# EAGLE design DrivePlexer (EAGLE 7.7.0)
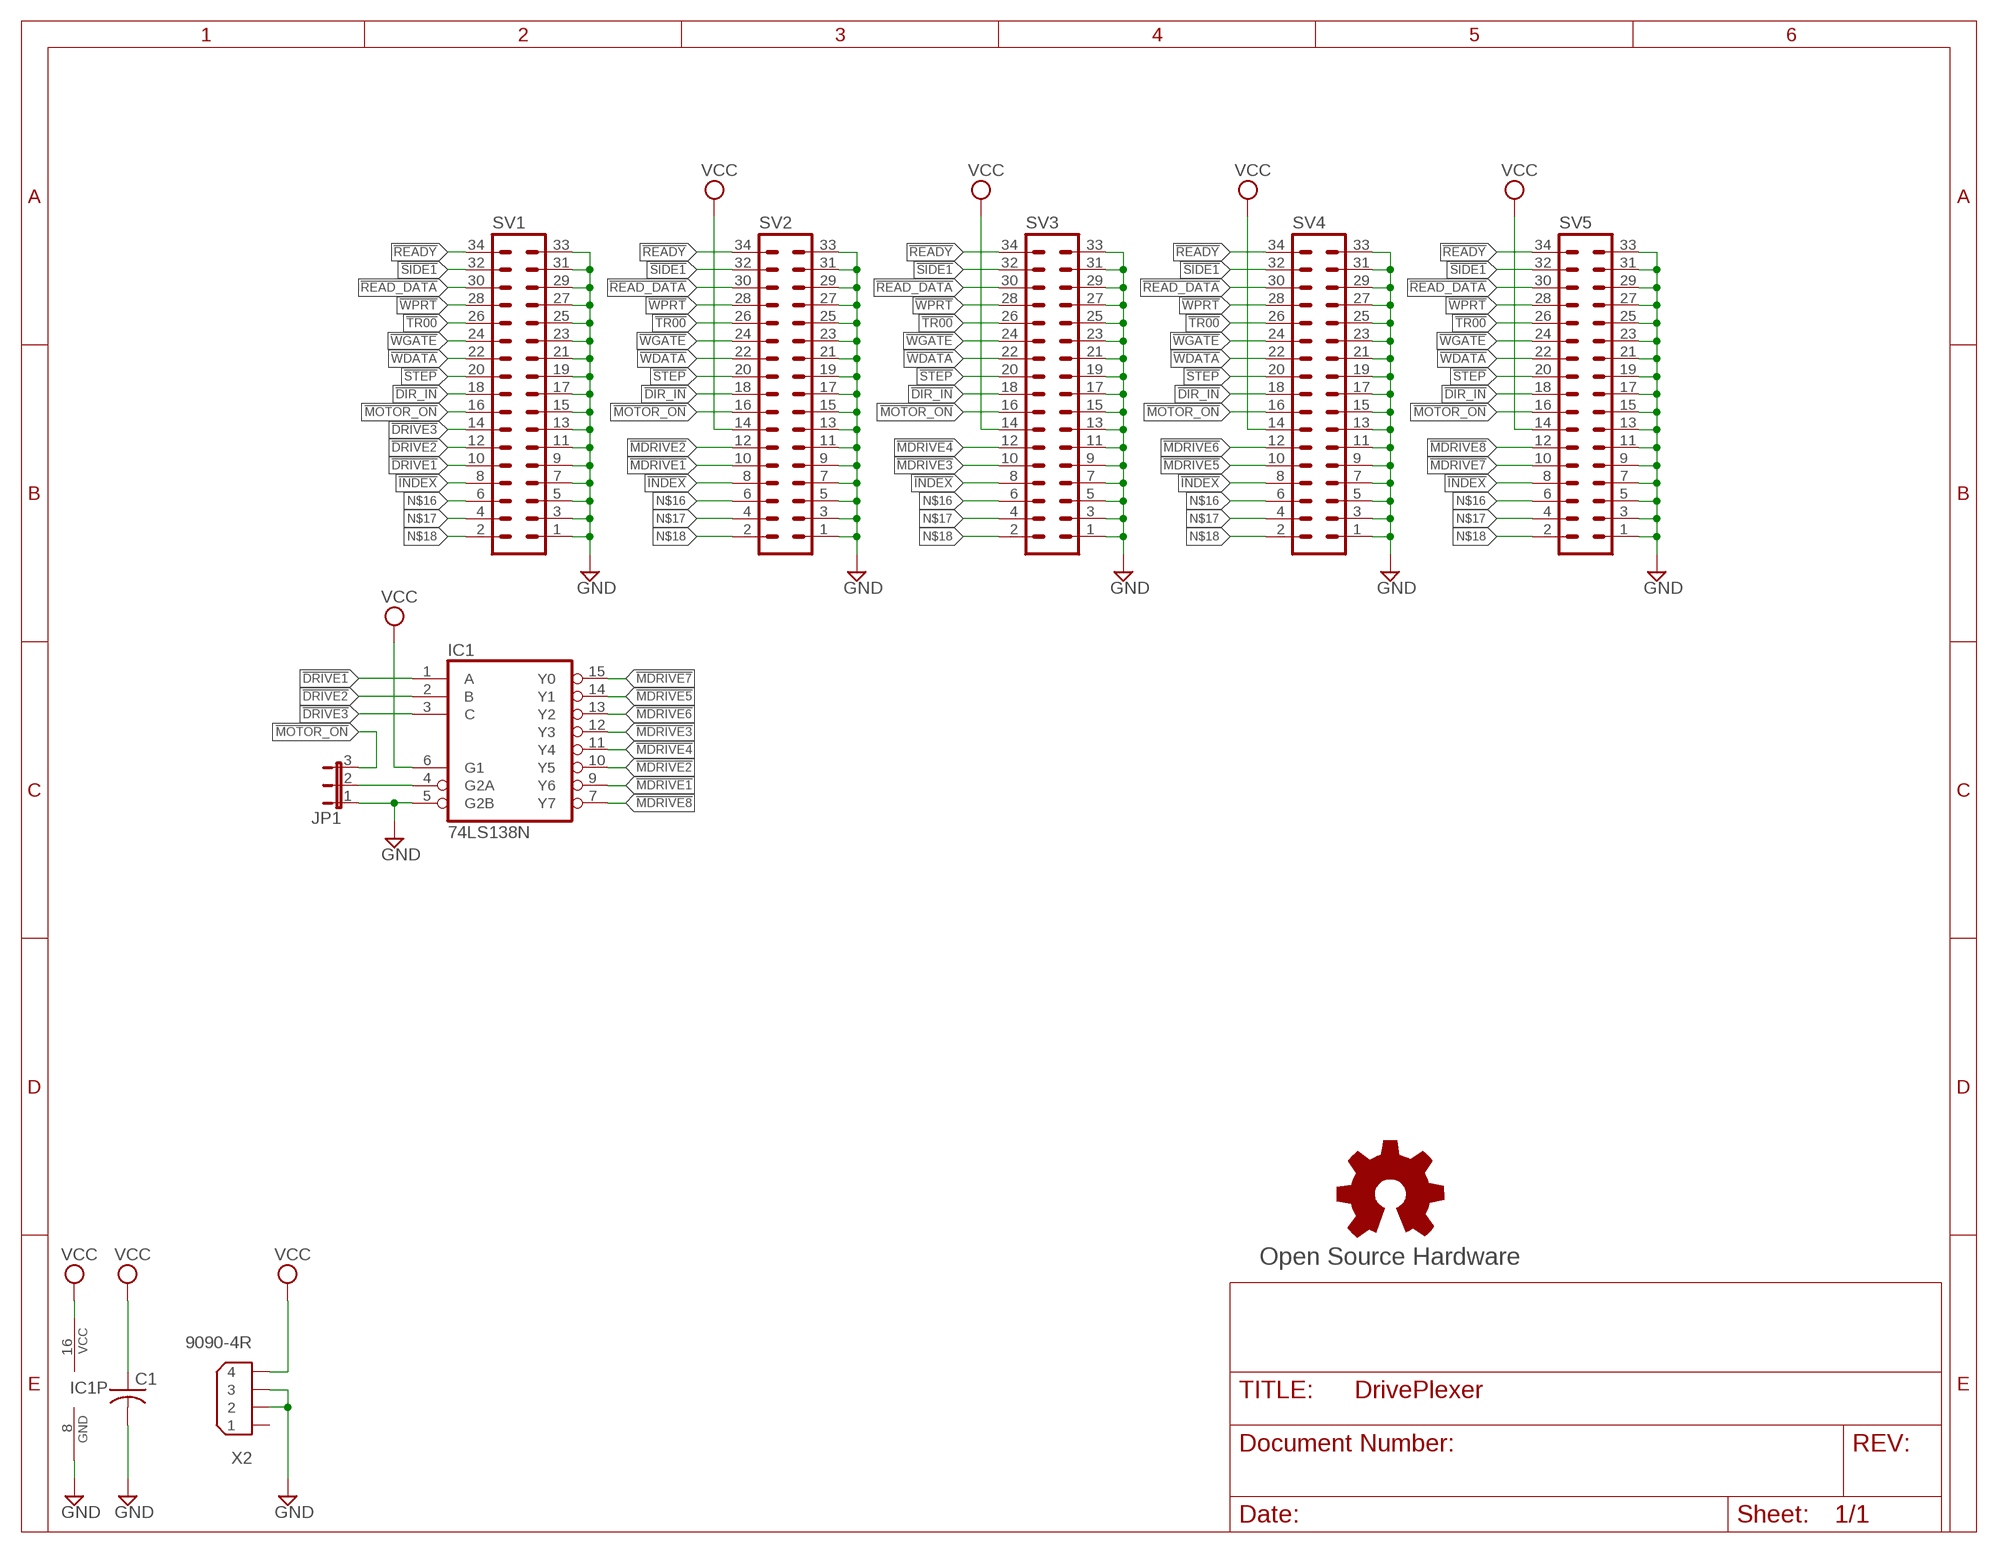
[diagram p0: schematic, sheet 1]

## Parts
C1  C-US025-025X050  [C025-025X050]
GOLD_ORB_SM1  Open Source Hardware  OSHWLOGOLOGO5MM  [OSHW_5MM]
IC1  74LS138N  [DIL16-RP]
JP1  JP2E  [JP2]
SV1  MA17-2  [MA17-2]
SV2  MA17-2  [MA17-2]
SV3  MA17-2  [MA17-2]
SV4  MA17-2  [MA17-2]
SV5  MA17-2  [MA17-2]
X2  9090-4R  [9090-4R]

## Nets
!DIR_IN: SV1.18 SV2.18 SV3.18 SV4.18 SV5.18
!DRIVE1: IC1.1(A) SV1.10
!DRIVE2: IC1.2(B) SV1.12
!DRIVE3: IC1.3(C) SV1.14
!INDEX: SV1.8 SV2.8 SV3.8 SV4.8 SV5.8
!MDRIVE1: IC1.9(Y6) SV2.10
!MDRIVE2: IC1.10(Y5) SV2.12
!MDRIVE3: IC1.12(Y3) SV3.10
!MDRIVE4: IC1.11(Y4) SV3.12
!MDRIVE5: IC1.14(Y1) SV4.10
!MDRIVE6: IC1.13(Y2) SV4.12
!MDRIVE7: IC1.15(Y0) SV5.10
!MDRIVE8: IC1.7(Y7) SV5.12
!MOTOR_ON: JP1.3 SV1.16 SV2.16 SV3.16 SV4.16 SV5.16
!READ_DATA: SV1.30 SV2.30 SV3.30 SV4.30 SV5.30
!READY: SV1.34 SV2.34 SV3.34 SV4.34 SV5.34
!SIDE1: SV1.32 SV2.32 SV3.32 SV4.32 SV5.32
!STEP: SV1.20 SV2.20 SV3.20 SV4.20 SV5.20
!TR00: SV1.26 SV2.26 SV3.26 SV4.26 SV5.26
!WDATA: SV1.22 SV2.22 SV3.22 SV4.22 SV5.22
!WGATE: SV1.24 SV2.24 SV3.24 SV4.24 SV5.24
!WPRT: SV1.28 SV2.28 SV3.28 SV4.28 SV5.28
GND: C1.2 IC1.5(G2B) IC1.8(GND) JP1.1 SV1.1 SV1.3 SV1.5 SV1.7 SV1.9 SV1.11 SV1.13 SV1.15 SV1.17 SV1.19 SV1.21 SV1.23 SV1.25 SV1.27 SV1.29 SV1.31 SV1.33 SV2.1 SV2.3 SV2.5 SV2.7 SV2.9 SV2.11 SV2.13 SV2.15 SV2.17 SV2.19 SV2.21 SV2.23 SV2.25 SV2.27 SV2.29 SV2.31 SV2.33 SV3.1 SV3.3 SV3.5 SV3.7 SV3.9 SV3.11 SV3.13 SV3.15 SV3.17 SV3.19 SV3.21 SV3.23 SV3.25 SV3.27 SV3.29 SV3.31 SV3.33 SV4.1 SV4.3 SV4.5 SV4.7 SV4.9 SV4.11 SV4.13 SV4.15 SV4.17 SV4.19 SV4.21 SV4.23 SV4.25 SV4.27 SV4.29 SV4.31 SV4.33 SV5.1 SV5.3 SV5.5 SV5.7 SV5.9 SV5.11 SV5.13 SV5.15 SV5.17 SV5.19 SV5.21 SV5.23 SV5.25 SV5.27 SV5.29 SV5.31 SV5.33 X2.2 X2.3
N$5: IC1.4(G2A) JP1.2
N$16: SV1.6 SV2.6 SV3.6 SV4.6 SV5.6
N$17: SV1.4 SV2.4 SV3.4 SV4.4 SV5.4
N$18: SV1.2 SV2.2 SV3.2 SV4.2 SV5.2
VCC: C1.1 IC1.6(G1) IC1.16(VCC) SV2.14 SV3.14 SV4.14 SV5.14 X2.4
Unconnected: X2.1

## Library data of the parts
C1 = rcl:C-US: CAPACITOR, American symbol
GOLD_ORB_SM1 = oshw:OSHWLOGO: The OSHW logo for PCB layout
IC1 = 74xx-us-jlb:74*138: 3-line to 8-line DECODER/DEMULTIPLEXER
JP1 = jumper-jlb:JP2E: JUMPER
SV1-SV5 = con-lstb-rp:MA17-2: PIN HEADER; OC_FARNELL: unknown; OC_NEWARK: unknown
X2 = con-thomas-betts:9090-4: Disk Drive Power four position Source: Thomas & Betts Electronic Interconnects Eiropean Edition 1998; OC_FARNELL: unknown; OC_NEWARK: unknown

## Board
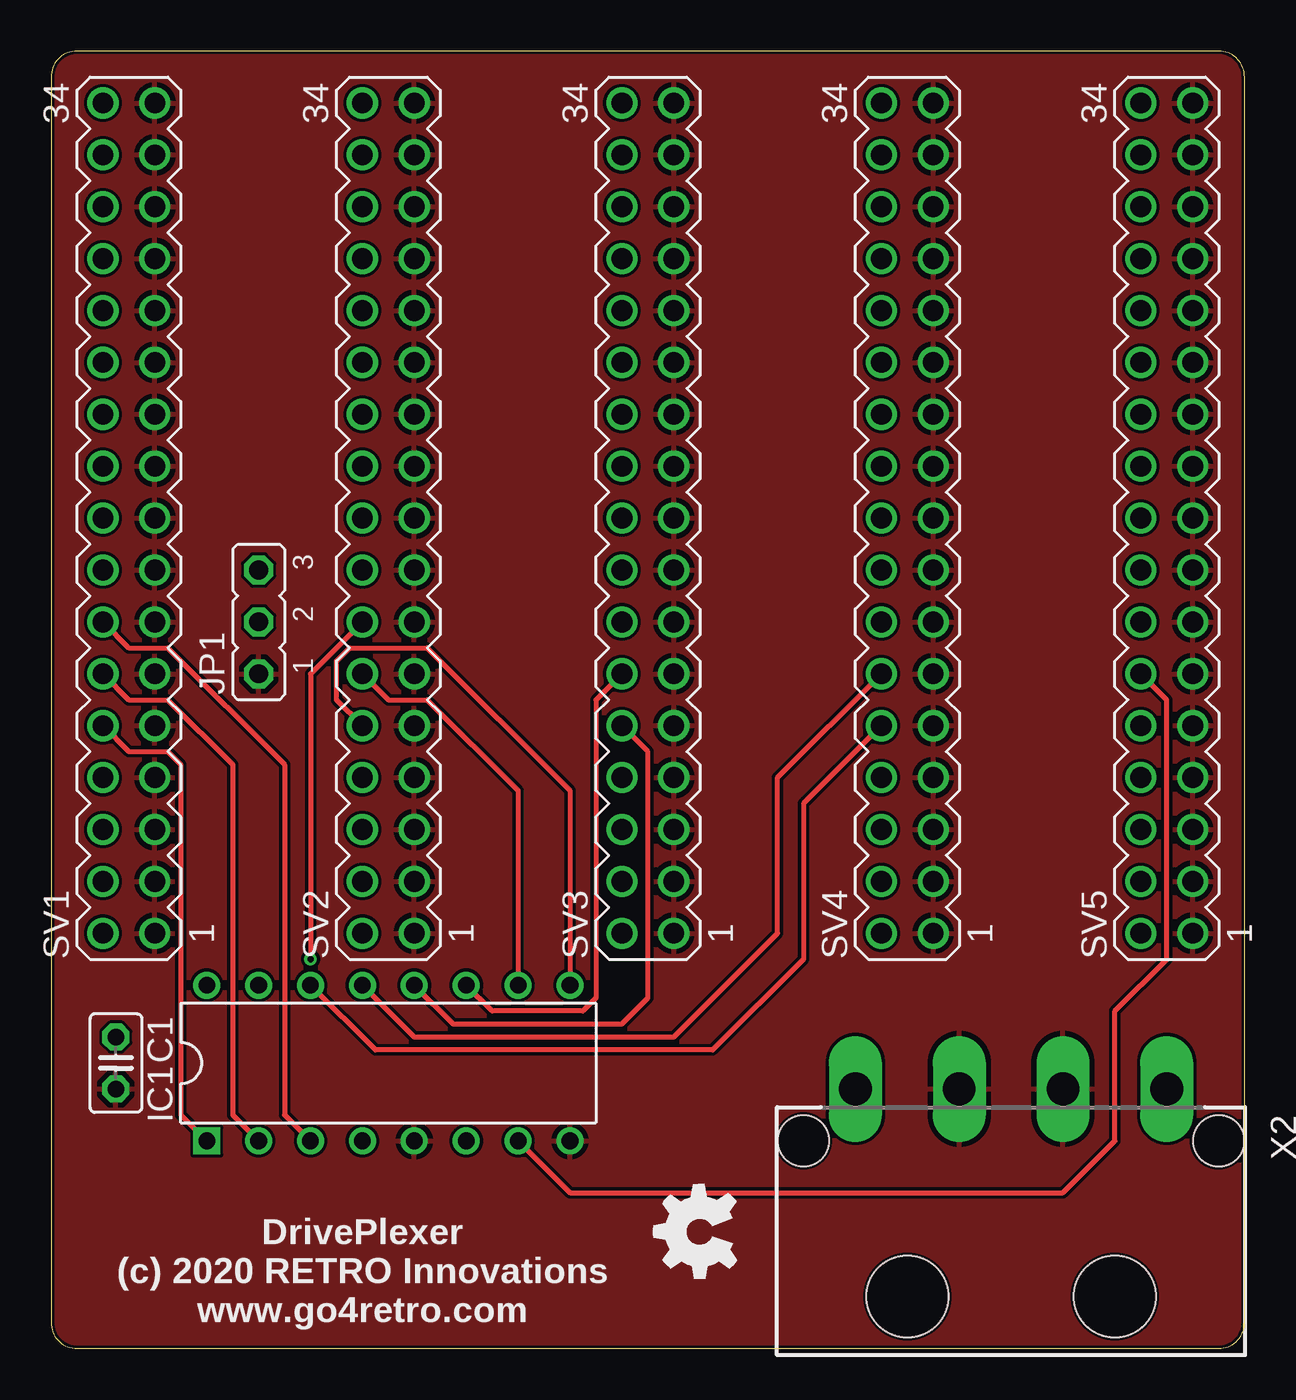
[diagram p1: board, top side]
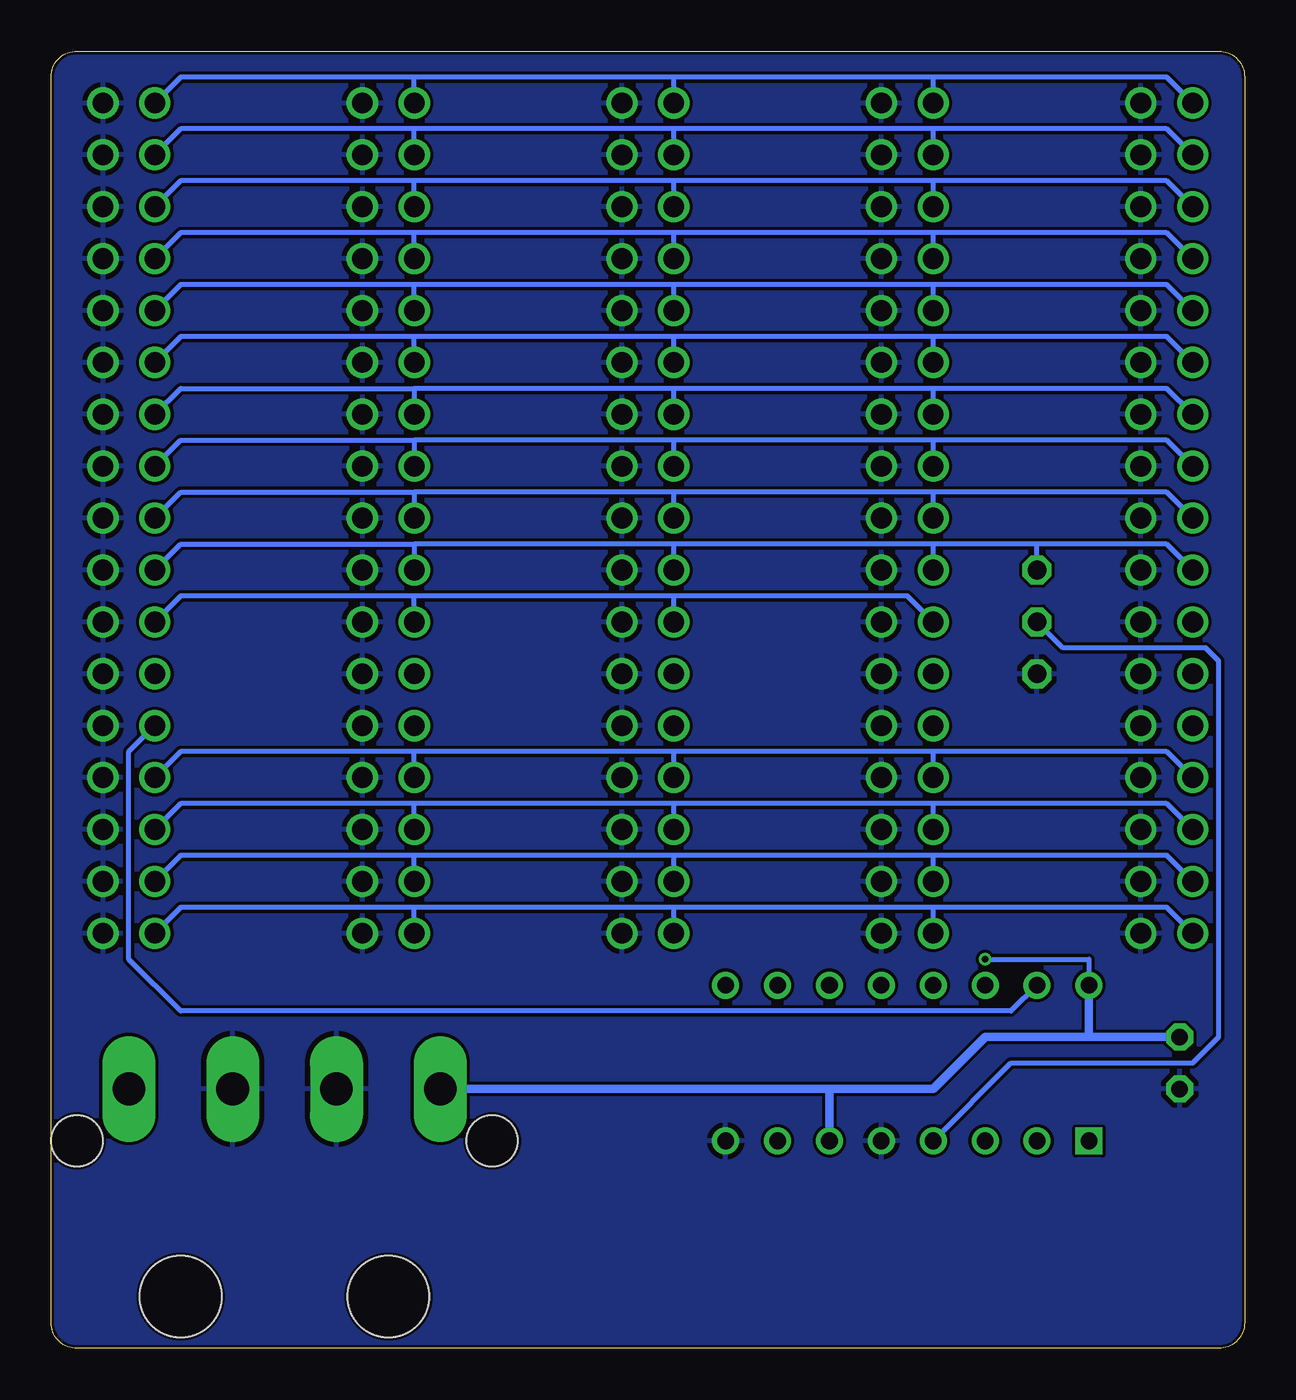
[diagram p2: board, bottom side, seen from below]

Size 58.42 x 63.5 mm. Coordinates in mm from the lower left corner, seen from the top.
Outline: 0,62.23 0,1.27 arc90 1.27,0 57.15,0 arc90 58.42,1.27 58.42,62.23 arc90 57.15,63.5 1.27,63.5 arc90 0,62.23
Copper layers (1*16): Top 0.035mm / dielectric 1.5mm / Bottom 0.035mm
Design rules "hackvana *": minimum track width 6mil, minimum drill 0.3mm, track to track 6mil, track to pad 6mil, pad to pad 6mil, via to via 6mil, smd to smd 0mil, copper to edge 6mil, drill to drill 6mil, minimum pad ring 10mil, minimum via ring 6mil, stop-mask expansion 2mil, vias tented up to drill 100mil, thermal gap 10mil

### Footprints (pad centres in the part's own frame; a part is rotated, then mirrored left to right if it is on the bottom)
C025-025X050 = drill 0.813 octagon: 1 -1.27,0; 2 1.27,0
DIL16-RP = drill 0.813 square: 1 -8.89,-3.81 | drill 0.813: 2 -6.35,-3.81; 3 -3.81,-3.81; 4 -1.27,-3.81; 5 1.27,-3.81; 6 3.81,-3.81; 7 6.35,-3.81; 8 8.89,-3.81; 9 8.89,3.81; 10 6.35,3.81; 11 3.81,3.81; 12 1.27,3.81; 13 -1.27,3.81; 14 -3.81,3.81; 15 -6.35,3.81; 16 -8.89,3.81
JP2 = drill 0.914 octagon: 1 -2.54,0; 2 0,0; 3 2.54,0
MA17-2 = drill 1.016: 1 -20.32,-1.27; 2 -20.32,1.27; 3 -17.78,-1.27; 4 -17.78,1.27; 5 -15.24,-1.27; 6 -15.24,1.27; 7 -12.7,-1.27; 8 -12.7,1.27; 9 -10.16,-1.27; 10 -10.16,1.27; 11 -7.62,-1.27; 12 -7.62,1.27; 13 -5.08,-1.27; 14 -5.08,1.27; 15 -2.54,-1.27; 16 -2.54,1.27; 17 0,-1.27; 18 0,1.27; 19 2.54,-1.27; 20 2.54,1.27; 21 5.08,-1.27; 22 5.08,1.27; 23 7.62,-1.27; 24 7.62,1.27; 25 10.16,-1.27; 26 10.16,1.27; 27 12.7,-1.27; 28 12.7,1.27; 29 15.24,-1.27; 30 15.24,1.27; 31 17.78,-1.27; 32 17.78,1.27; 33 20.32,-1.27; 34 20.32,1.27
9090-4R = drill 1.6 pad 2.6 long: 1 -7.62,-6.35; 2 -2.54,-6.35; 3 2.54,-6.35; 4 7.62,-6.35 | hole 4: -5.08,3.81; 5.08,3.81 | hole 2.5: -10.16,-3.81; 10.16,-3.81

### Placement (x,y rotation side)
C1  3.17,13.97 270 top
GOLD_ORB_SM1  31.75,5.71 90 top
IC1  16.51,13.97 0 top
JP1  10.16,35.56 90 top
SV1  3.81,40.64 90 top
SV2  16.51,40.64 90 top
SV3  29.21,40.64 90 top
SV4  41.91,40.64 90 top
SV5  54.61,40.64 90 top
X2  46.99,6.35 180 top

### Tracks (layer width: path | path; a pad name or v marks a point on that pad's centre or on a via)
!DIR_IN
  Bottom 0.254: SV1.18 3.81,41.91 15.24,41.91 | 15.24,41.91 27.94,41.91 | 27.94,41.91 40.64,41.91 | 40.64,41.91 SV4.18 | SV2.18 15.24,41.91 | SV3.18 27.94,41.91 | SV5.18 52.07,41.91 40.64,41.91
!DRIVE1
  Top 0.254: SV1.10 3.81,29.21 5.71,29.21 6.35,28.58 6.35,11.43 IC1.1
!DRIVE2
  Top 0.254: SV1.12 3.81,31.75 5.71,31.75 8.89,28.58 8.89,11.43 IC1.2
!DRIVE3
  Top 0.254: SV1.14 3.81,34.29 5.71,34.29 11.43,28.58 11.43,11.43 IC1.3
!INDEX
  Bottom 0.254: SV1.8 3.81,29.21 15.24,29.21 | 15.24,29.21 27.94,29.21 | 27.94,29.21 40.64,29.21 | 40.64,29.21 52.07,29.21 SV5.8 | SV2.8 15.24,29.21 | SV3.8 27.94,29.21 | SV4.8 40.64,29.21
!MDRIVE1
  Top 0.254: SV2.10 13.97,31.75 13.97,33.66 14.61,34.29 18.41,34.29 25.4,27.3 IC1.9
!MDRIVE2
  Top 0.254: SV2.12 16.51,31.75 18.41,31.75 22.86,27.3 IC1.10
!MDRIVE3
  Top 0.254: IC1.12 19.68,15.88 27.94,15.88 29.21,17.14 29.21,29.21 SV3.10
!MDRIVE4
  Top 0.254: SV3.12 26.67,31.75 26.67,17.14 26.04,16.51 21.59,16.51 IC1.11
!MDRIVE5
  Top 0.254: SV4.10 36.83,26.67 36.83,19.05 32.38,14.61 15.88,14.61 IC1.14
!MDRIVE6
  Top 0.254: IC1.13 17.78,15.24 30.48,15.24 35.56,20.32 35.56,27.94 SV4.12
!MDRIVE7
  Bottom 0.254: IC1.15 11.43,16.51 52.07,16.51 54.61,19.05 54.61,29.21 SV5.10
!MDRIVE8
  Top 0.254: IC1.7 25.4,7.62 49.53,7.62 52.07,10.16 52.07,16.51 54.61,19.05 54.61,31.75 SV5.12
!MOTOR_ON
  Bottom 0.254: SV1.16 3.81,39.37 10.16,39.37 | 10.16,39.37 15.24,39.37 | 15.24,39.37 27.94,39.37 | 27.94,39.37 40.64,39.37 | 40.64,39.37 SV4.16 | SV2.16 15.24,39.37 | SV3.16 27.94,39.37 | SV5.16 52.07,39.37 40.64,39.37 | JP1.3 10.16,39.37
!READ_DATA
  Bottom 0.254: SV1.30 3.81,57.15 15.24,57.15 | 15.24,57.15 27.94,57.15 | 27.94,57.15 40.64,57.15 | 40.64,57.15 52.07,57.15 SV5.30 | SV2.30 15.24,57.15 | SV3.30 27.94,57.15 | SV4.30 40.64,57.15
!READY
  Bottom 0.254: SV1.34 3.81,62.23 15.24,62.23 | 15.24,62.23 27.94,62.23 | 27.94,62.23 40.64,62.23 | 40.64,62.23 52.07,62.23 SV5.34 | SV4.34 40.64,62.23 | SV3.34 27.94,62.23 | SV2.34 15.24,62.23
!SIDE1
  Bottom 0.254: SV1.32 3.81,59.69 15.24,59.69 | 15.24,59.69 27.94,59.69 | 27.94,59.69 40.64,59.69 | 40.64,59.69 52.07,59.69 SV5.32 | SV2.32 15.24,59.69 | SV3.32 27.94,59.69 | SV4.32 40.64,59.69
!STEP
  Bottom 0.254: SV1.20 3.81,44.45 15.24,44.45 | 15.24,44.45 27.94,44.45 | 27.94,44.45 40.64,44.45 | 40.64,44.45 SV4.20 | SV2.20 15.24,44.45 | SV3.20 27.94,44.45 | SV5.20 52.07,44.45 40.64,44.45
!TR00
  Bottom 0.254: SV1.26 3.81,52.07 15.24,52.07 | 15.24,52.07 27.94,52.07 | 27.94,52.07 40.64,52.07 | 40.64,52.07 52.07,52.07 SV5.26 | SV2.26 15.24,52.07 | SV3.26 27.94,52.07 | SV4.26 40.64,52.07
!WDATA
  Bottom 0.254: SV1.22 3.81,46.99 15.24,46.99 | 15.24,46.99 27.94,46.99 | 27.94,46.99 40.64,46.99 | 40.64,46.99 SV4.22 | SV2.22 15.24,46.99 | SV3.22 27.94,46.99 | SV5.22 52.07,46.99 40.64,46.99
!WGATE
  Bottom 0.254: SV1.24 3.81,49.53 15.24,49.53 | 15.24,49.53 27.94,49.53 | 27.94,49.53 40.64,49.53 | 40.64,49.53 52.07,49.53 SV5.24 | SV2.24 15.24,49.53 | SV3.24 27.94,49.53 | SV4.24 40.64,49.53
!WPRT
  Bottom 0.254: SV1.28 3.81,54.61 15.24,54.61 | 15.24,54.61 27.94,54.61 | 27.94,54.61 40.64,54.61 | 40.64,54.61 52.07,54.61 SV5.28 | SV2.28 15.24,54.61 | SV3.28 27.94,54.61 | SV4.28 40.64,54.61
GND
  pour Top: 57.15,0 1.27,0 arc-90 0,1.27 0,62.23 arc-90 1.27,63.5 57.15,63.5 arc-90 58.42,62.23 58.42,1.27 arc-90
  pour Bottom: 57.15,0 1.27,0 arc-90 0,1.27 0,62.23 arc-90 1.27,63.5 57.15,63.5 arc-90 58.42,62.23 58.42,1.27 arc-90
N$5
  Bottom 0.254: IC1.4 11.43,13.97 2.54,13.97 1.27,15.24 1.27,33.66 1.91,34.29 8.89,34.29 JP1.2
N$16
  Bottom 0.254: SV1.6 3.81,26.67 15.24,26.67 | 15.24,26.67 27.94,26.67 | 27.94,26.67 40.64,26.67 | 40.64,26.67 52.07,26.67 SV5.6 | SV2.6 15.24,26.67 | SV3.6 27.94,26.67 | SV4.6 40.64,26.67
N$17
  Bottom 0.254: SV1.4 3.81,24.13 15.24,24.13 | 15.24,24.13 27.94,24.13 | 27.94,24.13 40.64,24.13 | 40.64,24.13 52.07,24.13 SV5.4 | SV2.4 15.24,24.13 | SV3.4 27.94,24.13 | SV4.4 40.64,24.13
N$18
  Bottom 0.254: SV1.2 3.81,21.59 15.24,21.59 | 15.24,21.59 27.94,21.59 | 27.94,21.59 40.64,21.59 | 40.64,21.59 52.07,21.59 SV5.2 | SV2.2 15.24,21.59 | SV3.2 27.94,21.59 | SV4.2 40.64,21.59
VCC  (via drill 0.3)
  Top 0.254: SV2.14 12.7,33.02 v12.7,19.05
  Bottom 0.254: SV2.14 16.51,36.83 27.94,36.83 | 27.94,36.83 40.64,36.83 | 40.64,36.83 52.07,36.83 SV5.14 | SV4.14 40.64,36.83 | SV3.14 27.94,36.83 | v12.7,19.05 7.62,19.05 IC1.16
  Bottom 0.406: C1.1 7.62,15.24 | 7.62,15.24 IC1.16 | X2.4 20.32,12.7 | 20.32,12.7 15.24,12.7 12.7,15.24 7.62,15.24 | IC1.6 20.32,12.7

### Text on the board
tNames: DrivePlexer / (c) 2020 RETRO Innovations / www.go4retro.com